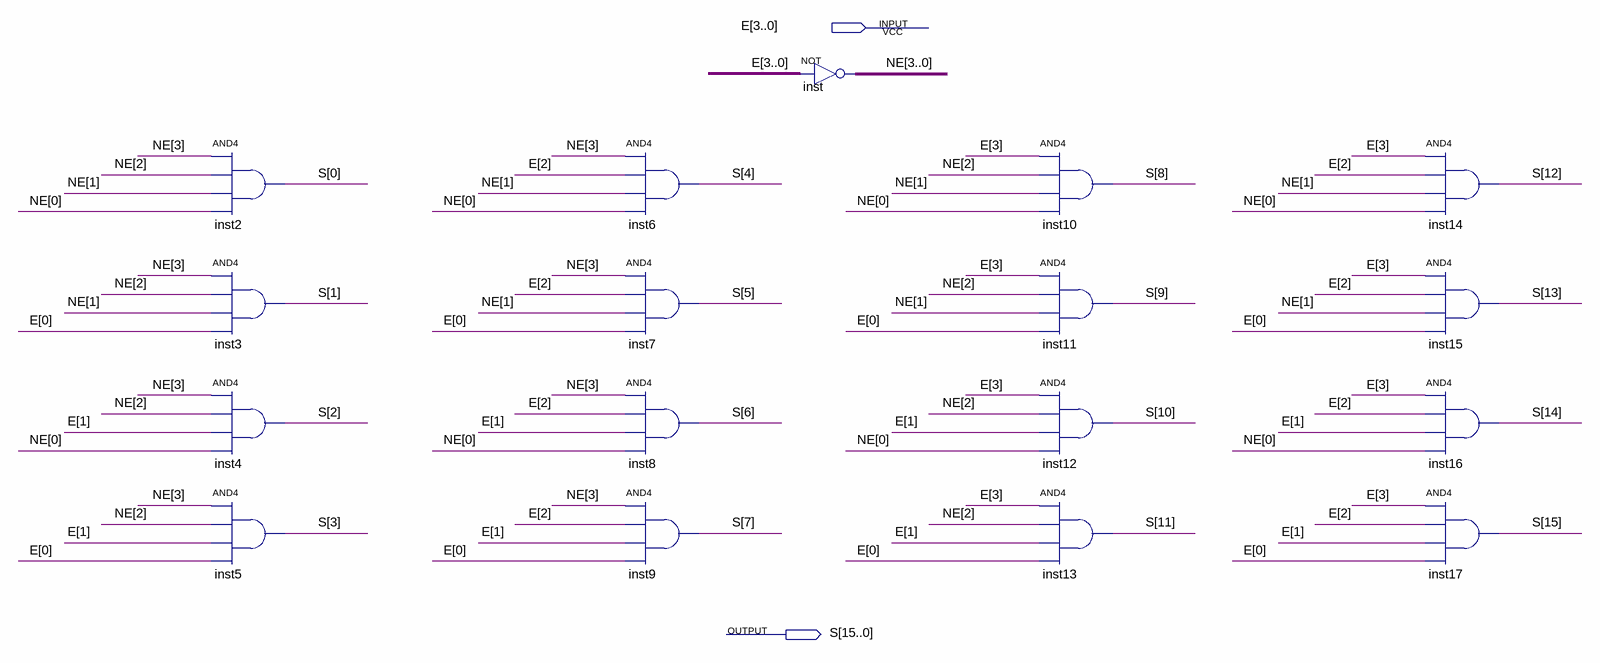
[diagram p0: schematic sheet]
// Quartus schematic DECOD.bdf as structural Verilog: 17 symbols, 2 pins
module DECOD (
  input  [3:0] E,
  output [15:0] S
);

  wire [3:0] NE;

  and inst2 (S[0], NE[3], NE[2], NE[1], NE[0]);
  and inst3 (S[1], NE[3], NE[2], NE[1], E[0]);
  and inst4 (S[2], NE[3], NE[2], E[1], NE[0]);
  and inst5 (S[3], NE[3], NE[2], E[1], E[0]);
  and inst6 (S[4], NE[3], E[2], NE[1], NE[0]);
  and inst7 (S[5], NE[3], E[2], NE[1], E[0]);
  and inst8 (S[6], NE[3], E[2], E[1], NE[0]);
  and inst9 (S[7], NE[3], E[2], E[1], E[0]);
  assign NE = ~E;  // NOT inst, 4 bits wide
  and inst10 (S[8], E[3], NE[2], NE[1], NE[0]);
  and inst11 (S[9], E[3], NE[2], NE[1], E[0]);
  and inst12 (S[10], E[3], NE[2], E[1], NE[0]);
  and inst13 (S[11], E[3], NE[2], E[1], E[0]);
  and inst14 (S[12], E[3], E[2], NE[1], NE[0]);
  and inst15 (S[13], E[3], E[2], NE[1], E[0]);
  and inst16 (S[14], E[3], E[2], E[1], NE[0]);
  and inst17 (S[15], E[3], E[2], E[1], E[0]);
endmodule
